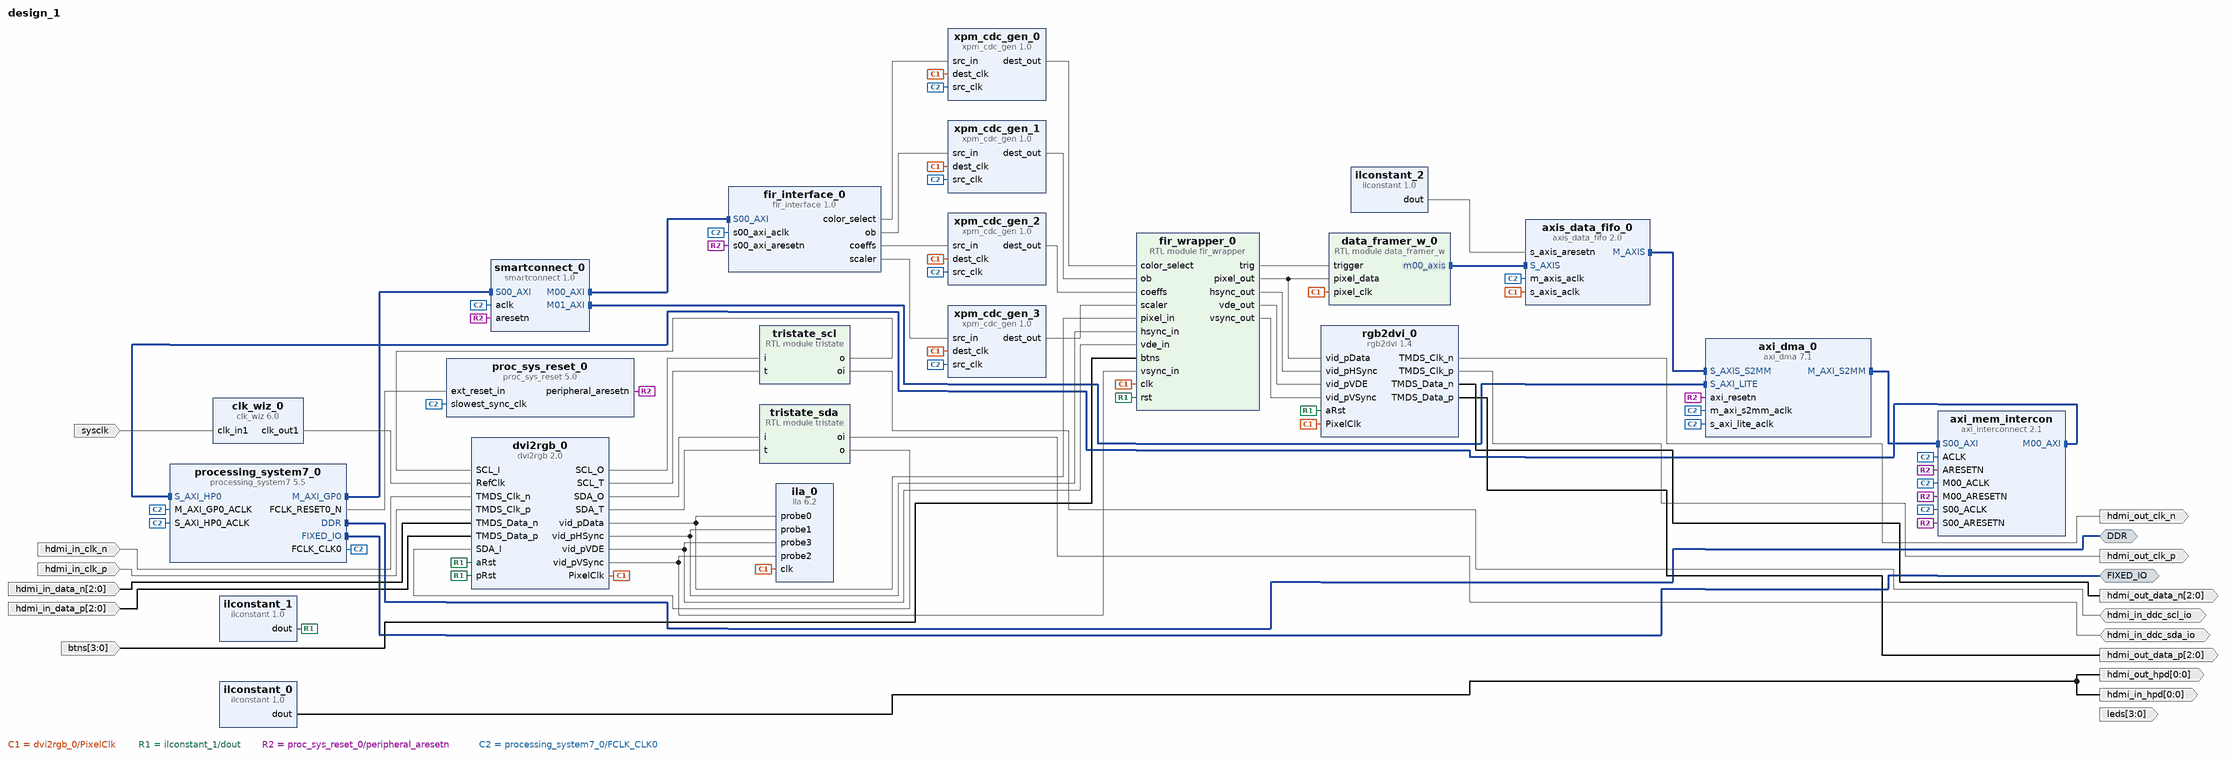
[diagram p0: block diagram of the top level]
# Vivado block design design_1, xc7z020clg400-1, Vivado 2025.1
create_bd_design design_1

create_bd_intf_port -mode Master -vlnv xilinx.com:interface:ddrx_rtl:1.0 DDR
create_bd_intf_port -mode Master -vlnv xilinx.com:display_processing_system7:fixedio_rtl:1.0 FIXED_IO
create_bd_port -dir I hdmi_in_clk_p
create_bd_port -dir I hdmi_in_clk_n
create_bd_port -dir I -from 2 -to 0 hdmi_in_data_p
create_bd_port -dir I -from 2 -to 0 hdmi_in_data_n
create_bd_port -dir I sysclk
create_bd_port -dir I -from 3 -to 0 btns
create_bd_port -dir O hdmi_out_clk_p
create_bd_port -dir O hdmi_out_clk_n
create_bd_port -dir O -from 2 -to 0 hdmi_out_data_p
create_bd_port -dir O -from 2 -to 0 hdmi_out_data_n
create_bd_port -dir O -from 0 -to 0 hdmi_in_hpd
create_bd_port -dir O -from 0 -to 0 hdmi_out_hpd
create_bd_port -dir O -from 3 -to 0 leds
create_bd_port -dir IO hdmi_in_ddc_scl_io
create_bd_port -dir IO hdmi_in_ddc_sda_io

create_bd_cell -type ip -vlnv xilinx.com:ip:processing_system7:5.5 processing_system7_0
set_property -dict [list \
  CONFIG.PCW_APU_PERIPHERAL_FREQMHZ 650 \
  CONFIG.PCW_CRYSTAL_PERIPHERAL_FREQMHZ 50 \
  CONFIG.PCW_ENET0_ENET0_IO {MIO 16 .. 27} \
  CONFIG.PCW_ENET0_GRP_MDIO_ENABLE 1 \
  CONFIG.PCW_ENET0_GRP_MDIO_IO {MIO 52 .. 53} \
  CONFIG.PCW_ENET0_PERIPHERAL_ENABLE 1 \
  CONFIG.PCW_ENET0_RESET_ENABLE 1 \
  CONFIG.PCW_ENET0_RESET_IO {MIO 9} \
  CONFIG.PCW_ENET_RESET_ENABLE 1 \
  CONFIG.PCW_ENET_RESET_SELECT {Share reset pin} \
  CONFIG.PCW_FPGA0_PERIPHERAL_FREQMHZ 100 \
  CONFIG.PCW_FPGA1_PERIPHERAL_FREQMHZ 50 \
  CONFIG.PCW_GPIO_MIO_GPIO_ENABLE 1 \
  CONFIG.PCW_GPIO_MIO_GPIO_IO MIO \
  CONFIG.PCW_I2C_RESET_ENABLE 1 \
  CONFIG.PCW_M_AXI_GP0_FREQMHZ 10 \
  CONFIG.PCW_PERIPHERAL_BOARD_PRESET part0 \
  CONFIG.PCW_PRESET_BANK1_VOLTAGE {LVCMOS 1.8V} \
  CONFIG.PCW_QSPI_GRP_FBCLK_ENABLE 1 \
  CONFIG.PCW_QSPI_GRP_FBCLK_IO {MIO 8} \
  CONFIG.PCW_QSPI_GRP_SINGLE_SS_ENABLE 1 \
  CONFIG.PCW_QSPI_GRP_SINGLE_SS_IO {MIO 1 .. 6} \
  CONFIG.PCW_QSPI_PERIPHERAL_ENABLE 1 \
  CONFIG.PCW_QSPI_QSPI_IO {MIO 1 .. 6} \
  CONFIG.PCW_SD0_GRP_CD_ENABLE 1 \
  CONFIG.PCW_SD0_GRP_CD_IO {MIO 47} \
  CONFIG.PCW_SD0_GRP_WP_ENABLE 0 \
  CONFIG.PCW_SD0_PERIPHERAL_ENABLE 1 \
  CONFIG.PCW_SD0_SD0_IO {MIO 40 .. 45} \
  CONFIG.PCW_SDIO_PERIPHERAL_FREQMHZ 50 \
  CONFIG.PCW_SINGLE_QSPI_DATA_MODE x4 \
  CONFIG.PCW_UART0_PERIPHERAL_ENABLE 1 \
  CONFIG.PCW_UART0_UART0_IO {MIO 14 .. 15} \
  CONFIG.PCW_UART1_PERIPHERAL_ENABLE 0 \
  CONFIG.PCW_UART_PERIPHERAL_FREQMHZ 100 \
  CONFIG.PCW_UIPARAM_DDR_BUS_WIDTH {16 Bit} \
  CONFIG.PCW_UIPARAM_DDR_FREQ_MHZ 525 \
  CONFIG.PCW_UIPARAM_DDR_PARTNO {MT41J256M16 RE-125} \
  CONFIG.PCW_USB0_PERIPHERAL_ENABLE 0 \
  CONFIG.PCW_USB_RESET_ENABLE 1 \
  CONFIG.PCW_USE_S_AXI_HP0 1 \
  CONFIG.preset None \
] [get_bd_cells processing_system7_0]
# 494 more settings of processing_system7_0 are not shown: defaults, MIO pin electricals, DDR timing, and values the tool derives
create_bd_cell -type ip -vlnv xilinx.com:ip:proc_sys_reset:5.0 proc_sys_reset_0
create_bd_cell -type ip -vlnv xilinx.com:ip:smartconnect:1.0 smartconnect_0
set_property -dict {CONFIG.NUM_MI 2 CONFIG.NUM_SI 1} [get_bd_cells smartconnect_0]
create_bd_cell -type ip -vlnv xilinx.com:ip:clk_wiz:6.0 clk_wiz_0
set_property -dict [list \
  CONFIG.CLKIN1_JITTER_PS 100.0 \
  CONFIG.CLKOUT1_DRIVES BUFG \
  CONFIG.CLKOUT1_JITTER 114.829 \
  CONFIG.CLKOUT1_PHASE_ERROR 98.575 \
  CONFIG.CLKOUT1_REQUESTED_OUT_FREQ 200.000 \
  CONFIG.CLKOUT2_DRIVES BUFG \
  CONFIG.CLKOUT3_DRIVES BUFG \
  CONFIG.CLKOUT4_DRIVES BUFG \
  CONFIG.CLKOUT5_DRIVES BUFG \
  CONFIG.CLKOUT6_DRIVES BUFG \
  CONFIG.CLKOUT7_DRIVES BUFG \
  CONFIG.MMCM_BANDWIDTH OPTIMIZED \
  CONFIG.MMCM_CLKFBOUT_MULT_F 10 \
  CONFIG.MMCM_CLKIN1_PERIOD 10.000 \
  CONFIG.MMCM_CLKIN2_PERIOD 10.000 \
  CONFIG.MMCM_CLKOUT0_DIVIDE_F 5 \
  CONFIG.MMCM_COMPENSATION ZHOLD \
  CONFIG.MMCM_DIVCLK_DIVIDE 1 \
  CONFIG.PLL_CLKIN_PERIOD 10.000 \
  CONFIG.PRIMITIVE PLL \
  CONFIG.USE_LOCKED false \
  CONFIG.USE_RESET false \
] [get_bd_cells clk_wiz_0]
create_bd_cell -type module -reference tristate tristate_scl
create_bd_cell -type module -reference tristate tristate_sda
create_bd_cell -type inline_hdl -vlnv xilinx.com:inline_hdl:ilconstant:1.0 ilconstant_0
create_bd_cell -type inline_hdl -vlnv xilinx.com:inline_hdl:ilconstant:1.0 ilconstant_1
set_property -dict {CONFIG.CONST_VAL 0} [get_bd_cells ilconstant_1]
create_bd_cell -type module -reference fir_wrapper fir_wrapper_0
create_bd_cell -type ip -vlnv localdomain:user:fir_interface:1.0 fir_interface_0
create_bd_cell -type ip -vlnv xilinx.com:ip:xpm_cdc_gen:1.0 xpm_cdc_gen_0
set_property -dict {CONFIG.WIDTH 3} [get_bd_cells xpm_cdc_gen_0]
create_bd_cell -type ip -vlnv xilinx.com:ip:xpm_cdc_gen:1.0 xpm_cdc_gen_1
set_property -dict {CONFIG.CDC_TYPE xpm_cdc_single CONFIG.WIDTH 1} [get_bd_cells xpm_cdc_gen_1]
create_bd_cell -type ip -vlnv xilinx.com:ip:xpm_cdc_gen:1.0 xpm_cdc_gen_2
set_property -dict {CONFIG.WIDTH 120} [get_bd_cells xpm_cdc_gen_2]
create_bd_cell -type ip -vlnv xilinx.com:ip:xpm_cdc_gen:1.0 xpm_cdc_gen_3
set_property -dict {CONFIG.WIDTH 8} [get_bd_cells xpm_cdc_gen_3]
create_bd_cell -type ip -vlnv xilinx.com:ip:ila:6.2 ila_0
set_property -dict {CONFIG.C_MONITOR_TYPE Native CONFIG.C_NUM_OF_PROBES 4 CONFIG.C_PROBE0_WIDTH 24} [get_bd_cells ila_0]
create_bd_cell -type ip -vlnv digilentinc.com:ip:dvi2rgb:2.0 dvi2rgb_0
set_property -dict {CONFIG.kClkRange 3 CONFIG.kDebug false} [get_bd_cells dvi2rgb_0]
create_bd_cell -type ip -vlnv digilentinc.com:ip:rgb2dvi:1.4 rgb2dvi_0
set_property -dict {CONFIG.kClkPrimitive MMCM CONFIG.kClkRange 2} [get_bd_cells rgb2dvi_0]
create_bd_cell -type ip -vlnv xilinx.com:ip:axi_dma:7.1 axi_dma_0
set_property -dict {CONFIG.c_include_mm2s 0 CONFIG.c_include_sg 0 CONFIG.c_sg_length_width 23} [get_bd_cells axi_dma_0]
create_bd_cell -type module -reference data_framer_w data_framer_w_0
create_bd_cell -type ip -vlnv xilinx.com:ip:axis_data_fifo:2.0 axis_data_fifo_0
set_property -dict [list \
  CONFIG.HAS_TLAST 1 \
  CONFIG.HAS_TSTRB 1 \
  CONFIG.IS_ACLK_ASYNC 1 \
  CONFIG.TDATA_NUM_BYTES 4 \
] [get_bd_cells axis_data_fifo_0]
create_bd_cell -type inline_hdl -vlnv xilinx.com:inline_hdl:ilconstant:1.0 ilconstant_2
create_bd_cell -type ip -vlnv xilinx.com:ip:axi_interconnect:2.1 axi_mem_intercon
set_property -dict {CONFIG.NUM_MI 1} [get_bd_cells axi_mem_intercon]

# ---- connections ----

connect_bd_intf_net [get_bd_intf_pins axi_dma_0/M_AXI_S2MM] [get_bd_intf_pins axi_mem_intercon/S00_AXI]
connect_bd_intf_net [get_bd_intf_pins axi_mem_intercon/M00_AXI] [get_bd_intf_pins processing_system7_0/S_AXI_HP0]
connect_bd_intf_net [get_bd_intf_pins axis_data_fifo_0/M_AXIS] [get_bd_intf_pins axi_dma_0/S_AXIS_S2MM]
connect_bd_intf_net [get_bd_intf_pins data_framer_w_0/m00_axis] [get_bd_intf_pins axis_data_fifo_0/S_AXIS]
connect_bd_intf_net [get_bd_intf_ports DDR] [get_bd_intf_pins processing_system7_0/DDR]
connect_bd_intf_net [get_bd_intf_ports FIXED_IO] [get_bd_intf_pins processing_system7_0/FIXED_IO]
connect_bd_intf_net [get_bd_intf_pins processing_system7_0/M_AXI_GP0] [get_bd_intf_pins smartconnect_0/S00_AXI]
connect_bd_intf_net [get_bd_intf_pins smartconnect_0/M00_AXI] [get_bd_intf_pins fir_interface_0/S00_AXI]
connect_bd_intf_net [get_bd_intf_pins smartconnect_0/M01_AXI] [get_bd_intf_pins axi_dma_0/S_AXI_LITE]
connect_bd_net [get_bd_ports hdmi_in_ddc_scl_io] [get_bd_pins tristate_scl/oi]
connect_bd_net [get_bd_ports hdmi_in_ddc_sda_io] [get_bd_pins tristate_sda/oi]
connect_bd_net [get_bd_pins dvi2rgb_0/PixelClk] \
  [get_bd_pins xpm_cdc_gen_0/dest_clk] [get_bd_pins xpm_cdc_gen_1/dest_clk] [get_bd_pins xpm_cdc_gen_2/dest_clk] \
  [get_bd_pins xpm_cdc_gen_3/dest_clk] [get_bd_pins ila_0/clk] [get_bd_pins rgb2dvi_0/PixelClk] \
  [get_bd_pins data_framer_w_0/pixel_clk] [get_bd_pins axis_data_fifo_0/s_axis_aclk] [get_bd_pins fir_wrapper_0/clk]
connect_bd_net [get_bd_ports btns] [get_bd_pins fir_wrapper_0/btns]
connect_bd_net [get_bd_pins clk_wiz_0/clk_out1] [get_bd_pins dvi2rgb_0/RefClk]
connect_bd_net [get_bd_pins dvi2rgb_0/SCL_O] [get_bd_pins tristate_scl/i]
connect_bd_net [get_bd_pins dvi2rgb_0/SCL_T] [get_bd_pins tristate_scl/t]
connect_bd_net [get_bd_pins dvi2rgb_0/SDA_O] [get_bd_pins tristate_sda/i]
connect_bd_net [get_bd_pins dvi2rgb_0/SDA_T] [get_bd_pins tristate_sda/t]
connect_bd_net [get_bd_pins dvi2rgb_0/vid_pData] [get_bd_pins ila_0/probe0] [get_bd_pins fir_wrapper_0/pixel_in]
connect_bd_net [get_bd_pins dvi2rgb_0/vid_pHSync] [get_bd_pins ila_0/probe1] [get_bd_pins fir_wrapper_0/hsync_in]
connect_bd_net [get_bd_pins dvi2rgb_0/vid_pVDE] [get_bd_pins ila_0/probe3] [get_bd_pins fir_wrapper_0/vde_in]
connect_bd_net [get_bd_pins dvi2rgb_0/vid_pVSync] [get_bd_pins ila_0/probe2] [get_bd_pins fir_wrapper_0/vsync_in]
connect_bd_net [get_bd_pins fir_interface_0/coeffs] [get_bd_pins xpm_cdc_gen_2/src_in]
connect_bd_net [get_bd_pins fir_interface_0/color_select] [get_bd_pins xpm_cdc_gen_0/src_in]
connect_bd_net [get_bd_pins fir_interface_0/ob] [get_bd_pins xpm_cdc_gen_1/src_in]
connect_bd_net [get_bd_pins fir_interface_0/scaler] [get_bd_pins xpm_cdc_gen_3/src_in]
connect_bd_net [get_bd_pins fir_wrapper_0/hsync_out] [get_bd_pins rgb2dvi_0/vid_pHSync]
connect_bd_net [get_bd_pins fir_wrapper_0/pixel_out] [get_bd_pins rgb2dvi_0/vid_pData] [get_bd_pins data_framer_w_0/pixel_data]
connect_bd_net [get_bd_pins fir_wrapper_0/trig] [get_bd_pins data_framer_w_0/trigger]
connect_bd_net [get_bd_pins fir_wrapper_0/vde_out] [get_bd_pins rgb2dvi_0/vid_pVDE]
connect_bd_net [get_bd_pins fir_wrapper_0/vsync_out] [get_bd_pins rgb2dvi_0/vid_pVSync]
connect_bd_net [get_bd_ports hdmi_in_clk_n] [get_bd_pins dvi2rgb_0/TMDS_Clk_n]
connect_bd_net [get_bd_ports hdmi_in_clk_p] [get_bd_pins dvi2rgb_0/TMDS_Clk_p]
connect_bd_net [get_bd_ports hdmi_in_data_n] [get_bd_pins dvi2rgb_0/TMDS_Data_n]
connect_bd_net [get_bd_ports hdmi_in_data_p] [get_bd_pins dvi2rgb_0/TMDS_Data_p]
connect_bd_net [get_bd_pins ilconstant_0/dout] [get_bd_ports hdmi_in_hpd] [get_bd_ports hdmi_out_hpd]
connect_bd_net [get_bd_pins ilconstant_1/dout] \
  [get_bd_pins rgb2dvi_0/aRst] [get_bd_pins dvi2rgb_0/aRst] [get_bd_pins dvi2rgb_0/pRst] [get_bd_pins fir_wrapper_0/rst]
connect_bd_net [get_bd_pins ilconstant_2/dout] [get_bd_pins axis_data_fifo_0/s_axis_aresetn]
connect_bd_net [get_bd_pins proc_sys_reset_0/peripheral_aresetn] \
  [get_bd_pins smartconnect_0/aresetn] [get_bd_pins fir_interface_0/s00_axi_aresetn] \
  [get_bd_pins axi_mem_intercon/S00_ARESETN] [get_bd_pins axi_mem_intercon/M00_ARESETN] \
  [get_bd_pins axi_mem_intercon/ARESETN] [get_bd_pins axi_dma_0/axi_resetn]
connect_bd_net [get_bd_pins processing_system7_0/FCLK_CLK0] \
  [get_bd_pins processing_system7_0/M_AXI_GP0_ACLK] [get_bd_pins smartconnect_0/aclk] \
  [get_bd_pins proc_sys_reset_0/slowest_sync_clk] [get_bd_pins fir_interface_0/s00_axi_aclk] \
  [get_bd_pins xpm_cdc_gen_3/src_clk] [get_bd_pins xpm_cdc_gen_2/src_clk] [get_bd_pins xpm_cdc_gen_0/src_clk] \
  [get_bd_pins xpm_cdc_gen_1/src_clk] [get_bd_pins axi_dma_0/s_axi_lite_aclk] [get_bd_pins axis_data_fifo_0/m_axis_aclk] \
  [get_bd_pins axi_mem_intercon/S00_ACLK] [get_bd_pins processing_system7_0/S_AXI_HP0_ACLK] \
  [get_bd_pins axi_mem_intercon/M00_ACLK] [get_bd_pins axi_mem_intercon/ACLK] [get_bd_pins axi_dma_0/m_axi_s2mm_aclk]
connect_bd_net [get_bd_pins processing_system7_0/FCLK_RESET0_N] [get_bd_pins proc_sys_reset_0/ext_reset_in]
connect_bd_net [get_bd_pins rgb2dvi_0/TMDS_Clk_n] [get_bd_ports hdmi_out_clk_n]
connect_bd_net [get_bd_pins rgb2dvi_0/TMDS_Clk_p] [get_bd_ports hdmi_out_clk_p]
connect_bd_net [get_bd_pins rgb2dvi_0/TMDS_Data_n] [get_bd_ports hdmi_out_data_n]
connect_bd_net [get_bd_pins rgb2dvi_0/TMDS_Data_p] [get_bd_ports hdmi_out_data_p]
connect_bd_net [get_bd_ports sysclk] [get_bd_pins clk_wiz_0/clk_in1]
connect_bd_net [get_bd_pins tristate_scl/o] [get_bd_pins dvi2rgb_0/SCL_I]
connect_bd_net [get_bd_pins tristate_sda/o] [get_bd_pins dvi2rgb_0/SDA_I]
connect_bd_net [get_bd_pins xpm_cdc_gen_0/dest_out] [get_bd_pins fir_wrapper_0/color_select]
connect_bd_net [get_bd_pins xpm_cdc_gen_1/dest_out] [get_bd_pins fir_wrapper_0/ob]
connect_bd_net [get_bd_pins xpm_cdc_gen_2/dest_out] [get_bd_pins fir_wrapper_0/coeffs]
connect_bd_net [get_bd_pins xpm_cdc_gen_3/dest_out] [get_bd_pins fir_wrapper_0/scaler]

# ---- address map ----
assign_bd_address -offset 0x00000000 -range 512M -target_address_space [get_bd_addr_spaces axi_dma_0/Data_S2MM] [get_bd_addr_segs processing_system7_0/S_AXI_HP0/HP0_DDR_LOWOCM]
assign_bd_address -offset 0x40400000 -range 64K -target_address_space [get_bd_addr_spaces processing_system7_0/Data] [get_bd_addr_segs axi_dma_0/S_AXI_LITE/Reg]
assign_bd_address -offset 0x43C00000 -range 64K -target_address_space [get_bd_addr_spaces processing_system7_0/Data] [get_bd_addr_segs fir_interface_0/S00_AXI/S00_AXI_reg]

validate_bd_design
save_bd_design
